# EAGLE design PEXternalizer (EAGLE 6.5.0)
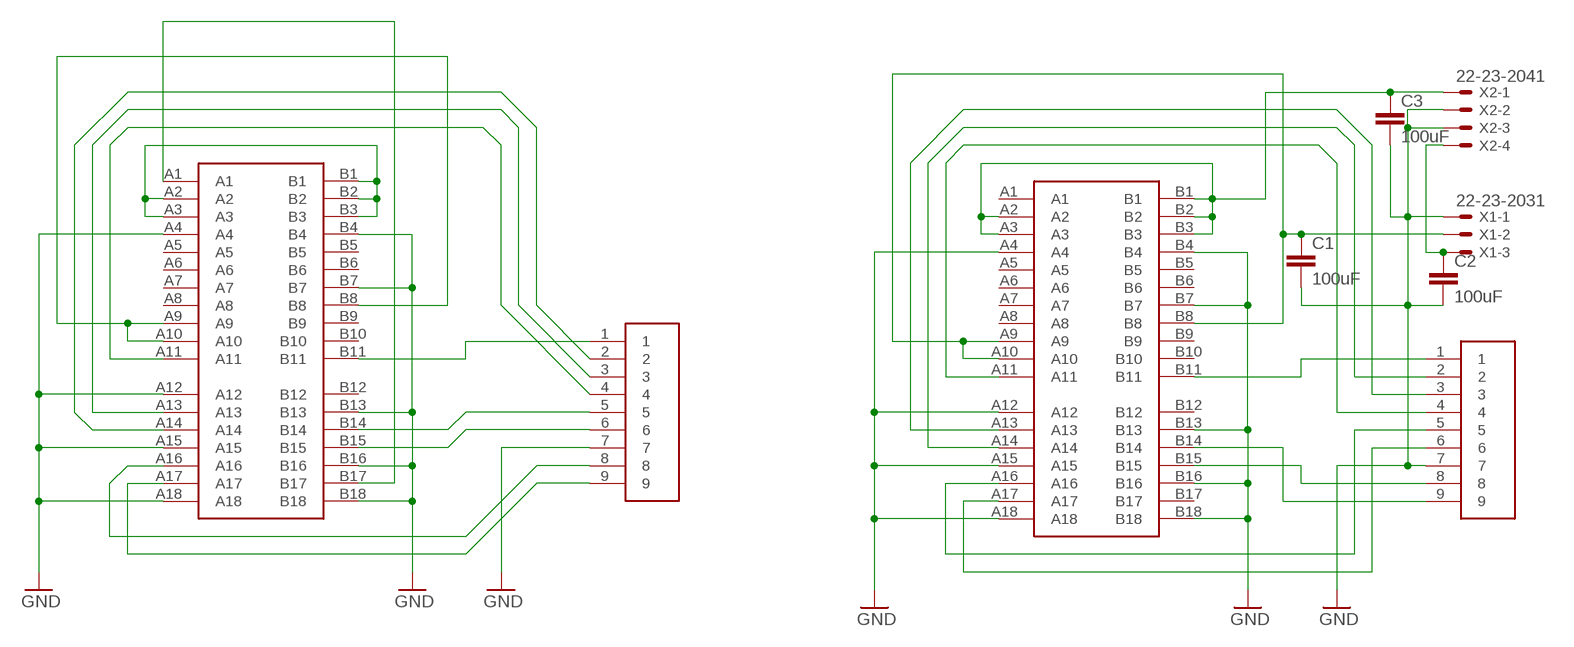
[diagram p0: schematic, sheet 1]

## Parts
3.3V  PCI-E1XEDGE  [PCI-E_36_EDGE]
3.3V1  PCI-E1XCONN  [PCI-E_36_CONN]
C1  100uF  C5/2.5  [C5B2.5]
C2  100uF  C5/2.5  [C5B2.5]
C3  100uF  C2.5/2  [C2.5-2]
U$1  USB3FLAT  [USB3_FLAT]
U$2  USB3FLAT  [USB3_FLAT]
X1  22-23-2031  [22-23-2031]
X2  22-23-2041  [22-23-2041]

## Nets
3.3V: 3.3V.A9 3.3V.A10 3.3V.B8
3.3V1: 3.3V1.A9 3.3V1.A10 3.3V1.B8 C1.1 X1.2
12V: 3.3V.A2 3.3V.A3 3.3V.B1 3.3V.B2 3.3V.B3
12V1: 3.3V1.A2 3.3V1.A3 3.3V1.B1 3.3V1.B2 3.3V1.B3 C3.1 X2.1
CLK2_N: 3.3V1.A14 U$2.2
CLK2_P: 3.3V1.A13 U$2.3
CLK_N: 3.3V.A13 U$1.3
CLK_P: 3.3V.A14 U$1.2
GND: 3.3V1.A4 3.3V1.A12 3.3V1.A15 3.3V1.A18 3.3V1.B4 3.3V1.B7 3.3V1.B13 3.3V1.B16 3.3V1.B18 3.3V.A4 3.3V.A12 3.3V.A15 3.3V.A18 3.3V.B4 3.3V.B7 3.3V.B13 3.3V.B16 3.3V.B18 C1.2 C2.2 C3.2 U$1.7 U$2.7 X1.1 X2.2 X2.3
N$3: 3.3V.B11 U$1.1
N$6: 3.3V.A1 3.3V.B17
N$7: 3.3V1.A11 U$2.4
N$8: 3.3V1.B11 U$2.1
N$11: C2.1 X1.3 X2.4
N$15: 3.3V.A11 U$1.4
RX1_N: 3.3V.A16 U$1.8
RX1_P: 3.3V.A17 U$1.9
RX2_N: 3.3V1.A16 U$2.5
RX2_P: 3.3V1.A17 U$2.6
TX1_N: 3.3V.B14 U$1.5
TX1_P: 3.3V.B15 U$1.6
TX2_N: 3.3V1.B15 U$2.8
TX2_P: 3.3V1.B14 U$2.9
Unconnected: 3.3V1.A1 3.3V1.A5 3.3V1.A6 3.3V1.A7 3.3V1.A8 3.3V1.B5 3.3V1.B6 3.3V1.B9 3.3V1.B10 3.3V1.B12 3.3V1.B17 3.3V.A5 3.3V.A6 3.3V.A7 3.3V.A8 3.3V.B5 3.3V.B6 3.3V.B9 3.3V.B10 3.3V.B12

## Library data of the parts
3.3V 3.3V1 = con-pci_express%28pci-e%29:PCI-E1X
C1-C3 = capacitor-wima:C: CAPACITOR naming: grid - package width
U$1 U$2 = con-pci_express%28pci-e%29:USB3
X1 = con-molex:22-23-2031: .100" (2.54mm) Center Header - 3 Pin; MF: MOLEX; MPN: 22-23-2031; OC_FARNELL: 1462950; OC_NEWARK: 30C0862
X2 = con-molex:22-23-2041: .100" (2.54mm) Center Header - 4 Pin; MF: MOLEX; MPN: 22-23-2041; OC_FARNELL: 1462920; OC_NEWARK: 38C0355

## Board
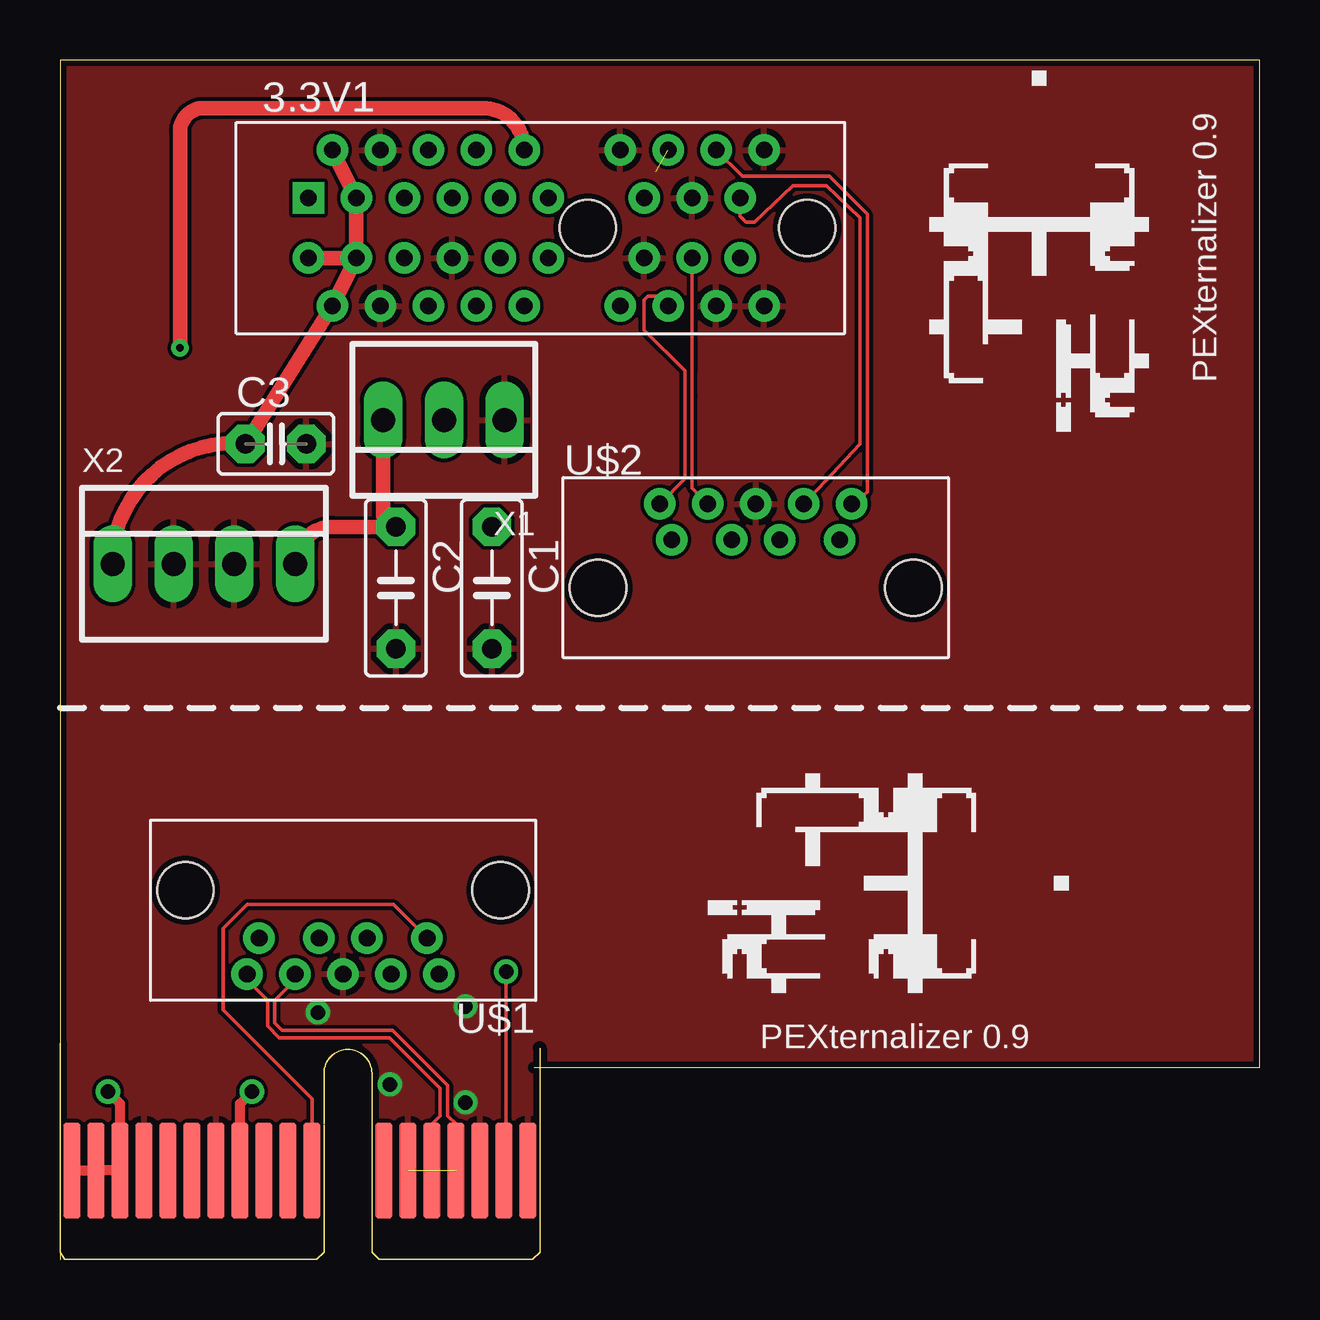
[diagram p1: board, top side]
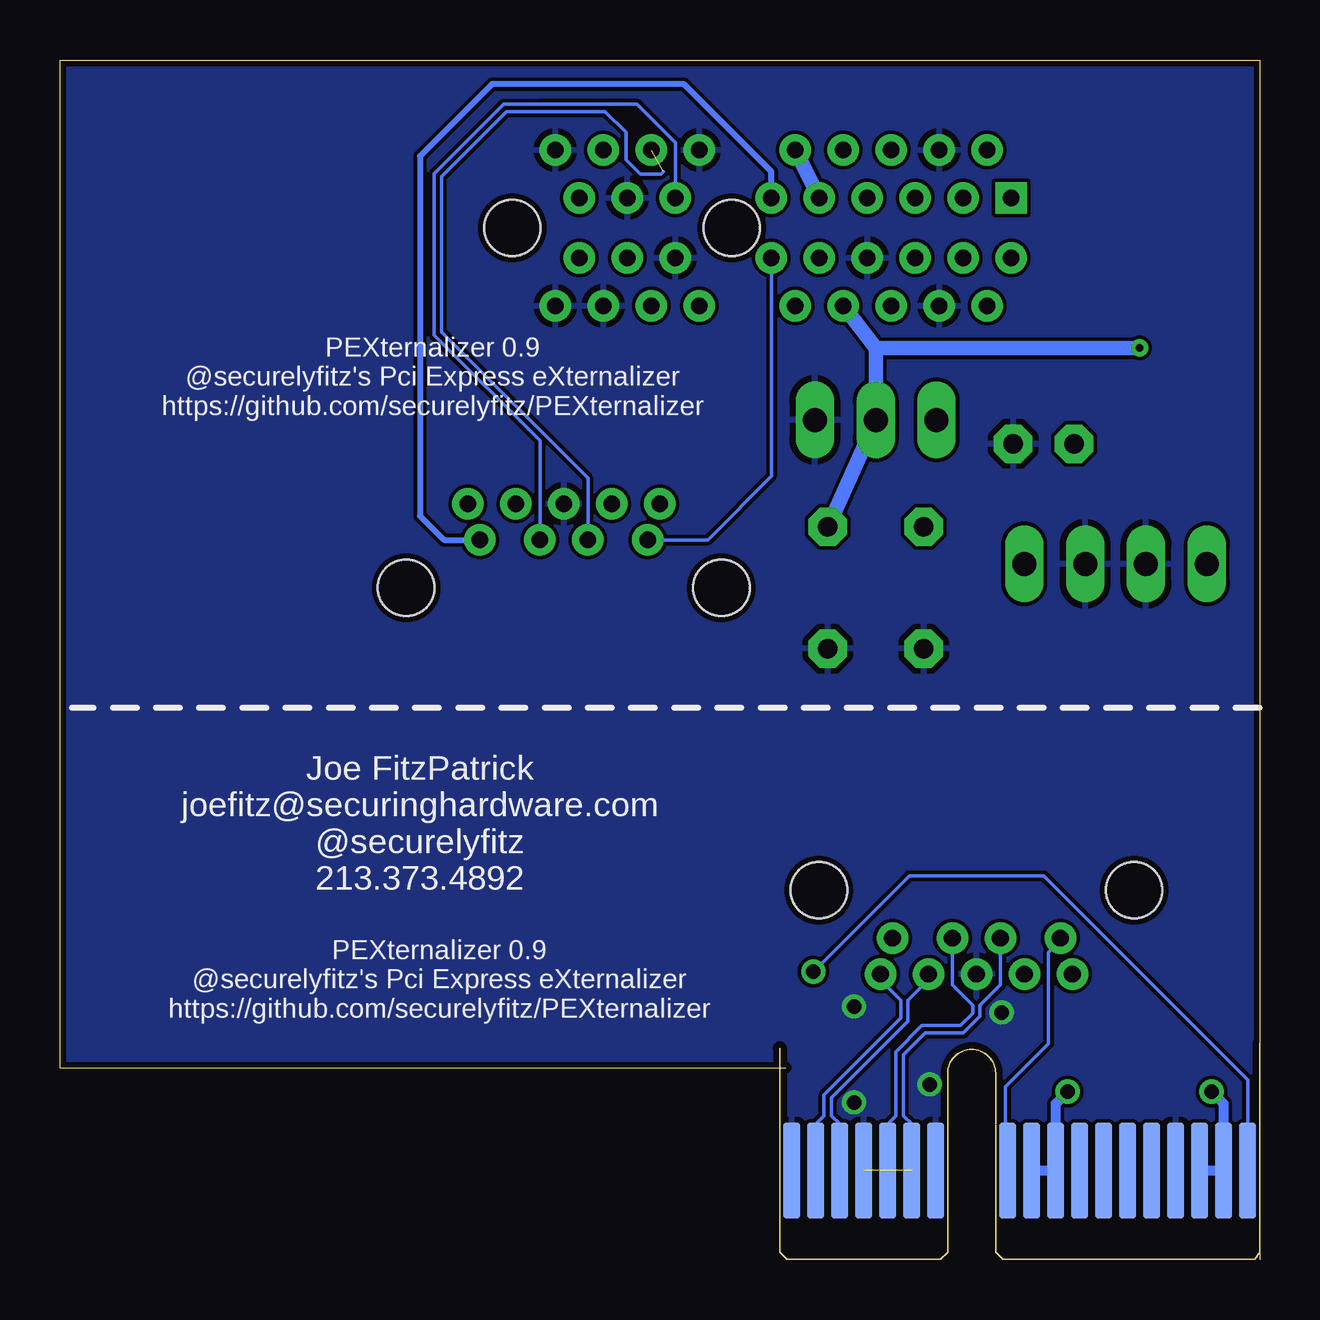
[diagram p2: board, bottom side, seen from below]

Size 50 x 50 mm. Coordinates in mm from the lower left corner, seen from the top.
Outline: 0,0 0,50 50,50 50,8 19.75,8
Copper layers (1*16): Top 0.035mm / dielectric 1.5mm / Bottom 0.035mm
Design rules "DFRobot_Eagle_Rule_v0.4": minimum track width 6mil, minimum drill 12mil, track to track 6mil, track to pad 6mil, pad to pad 6mil, via to via 6mil, smd to smd 0mil, copper to edge 10mil, drill to drill 10mil, minimum pad ring 12mil, minimum via ring 8mil, stop-mask expansion 2mil, vias tented up to drill 25mil, thermal gap 10mil

### Footprints (pad centres in the part's own frame; a part is rotated, then mirrored left to right if it is on the bottom)
PCI-E_36_EDGE = smd 0.7 x 4 bottom: A1 -9,0.01; A2 -8,0.01; A3 -7,0.01; A4 -6,0.01; A5 -5,0.01; A6 -4,0.01; A7 -3,0.01; A8 -2,0.01; A9 -1,0.01; A10 0,0.01; A11 1,0.01; A12 4,0.01; A13 5,0.01; A14 6,0.01; A15 7,0.01; A16 8,0.01; A17 9,0.01; A18 10,0.01 | smd 0.7 x 4: B1 -9,0.01; B2 -8,0.01; B3 -7,0.01; B4 -6,0.01; B5 -5,0.01; B6 -4,0.01; B7 -3,0.01; B8 -2,0.01; B9 -1,0.01; B10 0,0.01; B11 1,0.01; B12 4,0.01; B13 5,0.01; B14 6,0.01; B15 7,0.01; B16 8,0.01; B17 9,0.01; B18 10,0.01
PCI-E_36_CONN = drill 0.7 pad 1.27 square: A1 -11.65,1.25 | drill 0.7 pad 1.27: A2 -10.65,3.25; A3 -9.65,1.25; A4 -8.65,3.25; A5 -7.65,1.25; A6 -6.65,3.25; A7 -5.65,1.25; A8 -4.65,3.25; A9 -3.65,1.25; A10 -2.65,3.25; A11 -1.65,1.25; A12 1.35,3.25; A13 2.35,1.25; A14 3.35,3.25; A15 4.35,1.25; A16 5.35,3.25; A17 6.35,1.25; A18 7.35,3.25; B1 -11.65,-1.25; B2 -10.65,-3.25; B3 -9.65,-1.25; B4 -8.65,-3.25; B5 -7.65,-1.25; B6 -6.65,-3.25; B7 -5.65,-1.25; B8 -4.65,-3.25; B9 -3.65,-1.25; B10 -2.65,-3.25; B11 -1.65,-1.25; B12 1.35,-3.25; B13 2.35,-1.25; B14 3.35,-3.25; B15 4.35,-1.25; B16 5.35,-3.25; B17 6.35,-1.25; B18 7.35,-3.25 | hole 2.35: 0,0; 9.15,0
C5B2.5 = drill 0.813 pad 1.6 octagon: 1 -2.54,0; 2 2.54,0
C2.5-2 = drill 0.813 pad 1.6 octagon: 1 -1.27,0; 2 1.27,0
USB3_FLAT = drill 0.7 pad 1.27: 1 -3.5,2; 2 -1,2; 3 1,2; 4 3.5,2; 5 4,3.5; 6 2,3.5; 7 0,3.5; 8 -2,3.5; 9 -4,3.5 | hole 2.35: -6.57,0; 6.57,0
22-23-2031 = drill 1 long: 1 -2.54,0; 2 0,0; 3 2.54,0
22-23-2041 = drill 1 long: 1 -3.81,0; 2 -1.27,0; 3 1.27,0; 4 3.81,0

### Placement (x,y rotation side)
3.3V  9.5,3.7 0 top
3.3V1  22,43 0 top
C1  18,28 270 top
C2  14,28 270 top
C3  9,34 0 top
U$1  11.8,15.4 180 top
U$2  29,28 0 top
U$3  [SH]  46.5,34 90 top
U$4  [SH]  26.5,10 0 top
X1  16,35 180 top
X2  6,29 0 top

### Tracks (layer width: path | path; a pad name or v marks a point on that pad's centre or on a via)
3.3V  (via drill 0.6)
  Top 0.406: 3.3V.B8 7.5,6.5 v8,7
  Bottom 0.406: 3.3V.A10 3.3V.A9 8.5,6.5 v8,7
3.3V1  (via drill 0.3)
  Top 0.61: 3.3V1.A10 arc90 17.6,48 6,48 arc90 5,47 v5,38
  Bottom 0.61: 3.3V1.A10 3.3V1.A9 | 16,38 X1.2 C1.1 | 16,38 v5,38 | 3.3V1.B8 16,38
12V  (via drill 0.6)
  Top 0.406: v2,7 2.5,6.5 3.3V.B3 3.3V.B2 3.3V.B1
  Bottom 0.406: v2,7 1.5,6.5 3.3V.B2 3.3V.B3
12V1
  Top 0.61: 3.3V1.B1 3.3V1.B3 | 3.3V1.B3 3.3V1.A3 3.3V1.A2 | 3.3V1.B3 3.3V1.B2 C3.1 arc90 2.19,29.46 X2.1
CLK2_N  (1 unrouted)
  Bottom 0.152: U$2.2 28,32.57 34.1,38.66 34.1,45.14 31.39,47.85 27.28,47.85 26.41,46.98 26.41,45.85 25.81,45.25 24.94,45.25 24.84,45.35
CLK2_P
  Bottom 0.152: U$2.3 30,34.13 34.4,38.54 34.4,45.26 31.51,48.15 30,48.15 29.99,48.16 25.95,48.16 24.35,46.56 3.3V1.A13
CLK_N
  Bottom 0.152: U$1.3 10.8,11.45 11.65,10.6 11.65,10.14 12.34,9.45 13.94,9.45 14.85,8.54 14.85,6 14.5,5.65 3.3V.A13
CLK_P
  Bottom 0.152: U$1.2 12.8,11.45 11.95,10.6 11.95,10.26 12.46,9.75 14.06,9.75 15.15,8.66 15.15,6 15.5,5.65 3.3V.A14
GND  (via drill 0.6)  (1 unrouted)
  other vias: 13.75,7.3 10.75,10.3 16.9,6.55 16.9,10.55
  pour Bottom: 50,4 0,4 0,50 50,50
  pour Top: 0,50 50,50 50,4 0,4
N$3
  Top 0.152: 3.3V.B11 10.5,6.7 6.8,10.4 6.8,13.8 7.8,14.8 13.9,14.8 U$1.1
N$6  (via drill 0.6)
  Top 0.152: v18.6,12 18.6,3.81 3.3V.B17
  Bottom 0.152: 3.3V.A1 0.5,7.5 9,16 14.6,16 v18.6,12
N$7
  Bottom 0.254: 3.3V1.A11 20.35,45.35 24,49 32,49 35,46 35,31 34,30 U$2.4
N$8
  Bottom 0.152: U$2.1 23,30 20.35,32.65 3.3V1.B11
N$11
  Top 0.61: X2.4 arc-90 11.35,30.54 C2.1 arc-90 13.46,31.08 X1.3
N$15
  Bottom 0.152: U$1.4 8.3,13.3 8.8,12.8 8.8,9 10.6,7.2 10.6,3.81 3.3V.A11
RX1_N
  Bottom 0.152: U$1.8 13.8,11.65 14.65,10.8 14.65,9.94 17.85,6.74 17.85,6 17.5,5.65 3.3V.A16
RX1_P
  Bottom 0.152: U$1.9 15.8,11.65 14.95,10.8 14.95,10.06 18.15,6.86 18.15,6 18.5,5.65 3.3V.A17
RX2_N
  Top 0.152: U$2.5 33.65,32 33.65,43.56 32.06,45.15 28.45,45.15 3.3V1.A16
RX2_P
  Top 0.152: U$2.6 33.35,34 33.35,43.44 31.94,44.76 30.56,44.76 28.95,43.25 28.6,43.25 28.35,43.5 3.3V1.A17
TX1_N
  Top 0.152: 3.3V.B14 15.5,5.65 15.85,6 15.85,7.14 13.74,9.25 9.14,9.25 8.65,9.74 8.65,10.8 7.8,11.65 U$1.5
TX1_P
  Top 0.152: 3.3V.B15 16.5,5.65 16.15,6 16.15,7.26 13.86,9.55 9.26,9.55 8.95,9.86 8.95,10.8 9.8,11.65 U$1.6
TX2_N
  Top 0.152: U$2.8 26.35,32.15 26.35,36 26.35,37.05 3.3V1.B15
TX2_P
  Top 0.152: U$2.9 26.05,32.55 26.05,37.05 24.35,38.75 24.35,40 24.5,40.15 24.95,40.15 3.3V1.B14

### Text on the board
tPlace: PEXternalizer 0.9 | PEXternalizer 0.9
bPlace: PEXternalizer 0.9 / @securelyfitz's Pci Express eXternalizer / https://github.com/securelyfitz/PEXternalizer | Joe FitzPatrick / joefitz@securinghardware.com / @securelyfitz / 213.373.4892 | PEXternalizer 0.9 / @securelyfitz's Pci Express eXternalizer / https://github.com/securelyfitz/PEXternalizer